# Altium schematic sheet 扩展存储器电路symbol.SchDoc
size A4
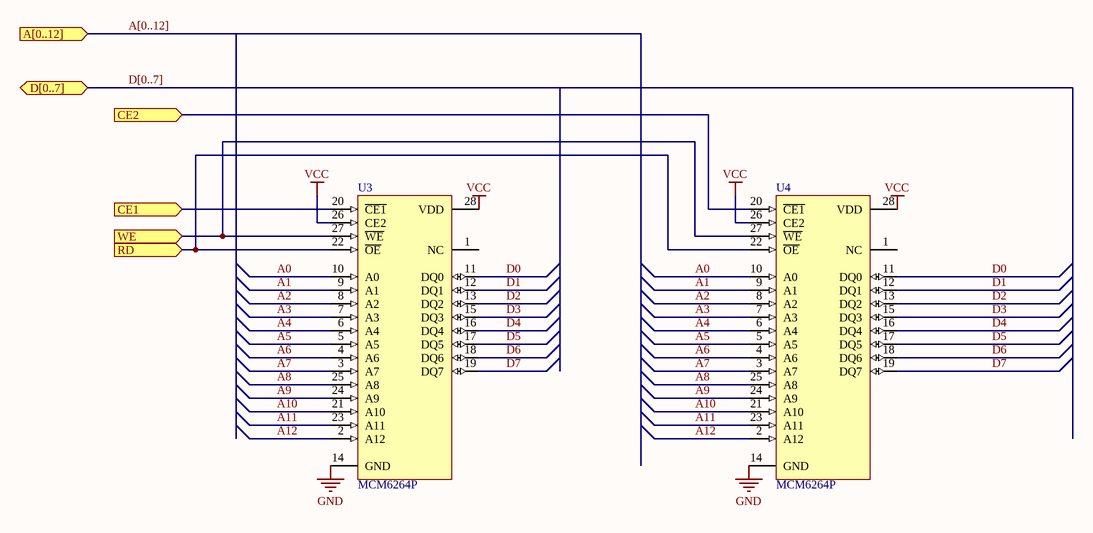
[diagram p0: 扩展存储器电路symbol.SchDoc]

## Parts
U3  MCM6264P  [710B-01]
U4  MCM6264P  [710B-01]

## Ports
A[0..12] (in), CE1 (in), CE2 (in), D[0..7] (bidir), RD (in), WE (in)

## Nets
GND: U3.14(GND) U4.14(GND)
VCC: U3.26(CE2) U3.28(VDD) U4.26(CE2) U4.28(VDD)
A0: U3.10(A0) U4.10(A0)
A1: U3.9(A1) U4.9(A1)
A2: U3.8(A2) U4.8(A2)
A3: U3.7(A3) U4.7(A3)
A4: U3.6(A4) U4.6(A4)
A5: U3.5(A5) U4.5(A5)
A6: U3.4(A6) U4.4(A6)
A7: U3.3(A7) U4.3(A7)
A8: U3.25(A8) U4.25(A8)
A9: U3.24(A9) U4.24(A9)
A10: U3.21(A10) U4.21(A10)
A11: U3.23(A11) U4.23(A11)
A12: U3.2(A12) U4.2(A12)
CE1: U3.20(~{CE1}) ; port CE1
CE2: U4.20(~{CE1}) ; port CE2
D0: U3.11(DQ0) U4.11(DQ0)
D1: U3.12(DQ1) U4.12(DQ1)
D2: U3.13(DQ2) U4.13(DQ2)
D3: U3.15(DQ3) U4.15(DQ3)
D4: U3.16(DQ4) U4.16(DQ4)
D5: U3.17(DQ5) U4.17(DQ5)
D6: U3.18(DQ6) U4.18(DQ6)
D7: U3.19(DQ7) U4.19(DQ7)
RD: U3.22(~{OE}) U4.22(~{OE}) ; port RD
WE: U3.27(~{WE}) U4.27(~{WE}) ; port WE

Not connected (* = marked no-connect by the designer): U3 1(NC); U4 1(NC)

## Buses and harness runs
bus A[0..12] = port A[0..12]
bus D[0..7] = port D[0..7]

## Notes on the sheet
- 专升本
- 通信工程
- 李烨攀
- 2101班
- 210806300163
- 学号

## Library data of the parts
U3 U4 = MCM6264P: 8K x 8-Bit Fast Static RAM; Published: 17-Jul-2002; LatestRevisionDate: 06-Jun-2005; LatestRevisionNote: Stylized 3D Model Added.; DatasheetVersion: 1991; PackageReference: 710B-01; Publisher: Altium Limited; PackageDescription: DIP; 28 Leads; Row Spacing 7.62 mm; Pitch 2.54 mm; ComponentLink1Description: Manufacturer Link; ComponentLink1URL: http://www.motorola.com/